# EAGLE design cc3100-breakout (EAGLE 6.5.0)
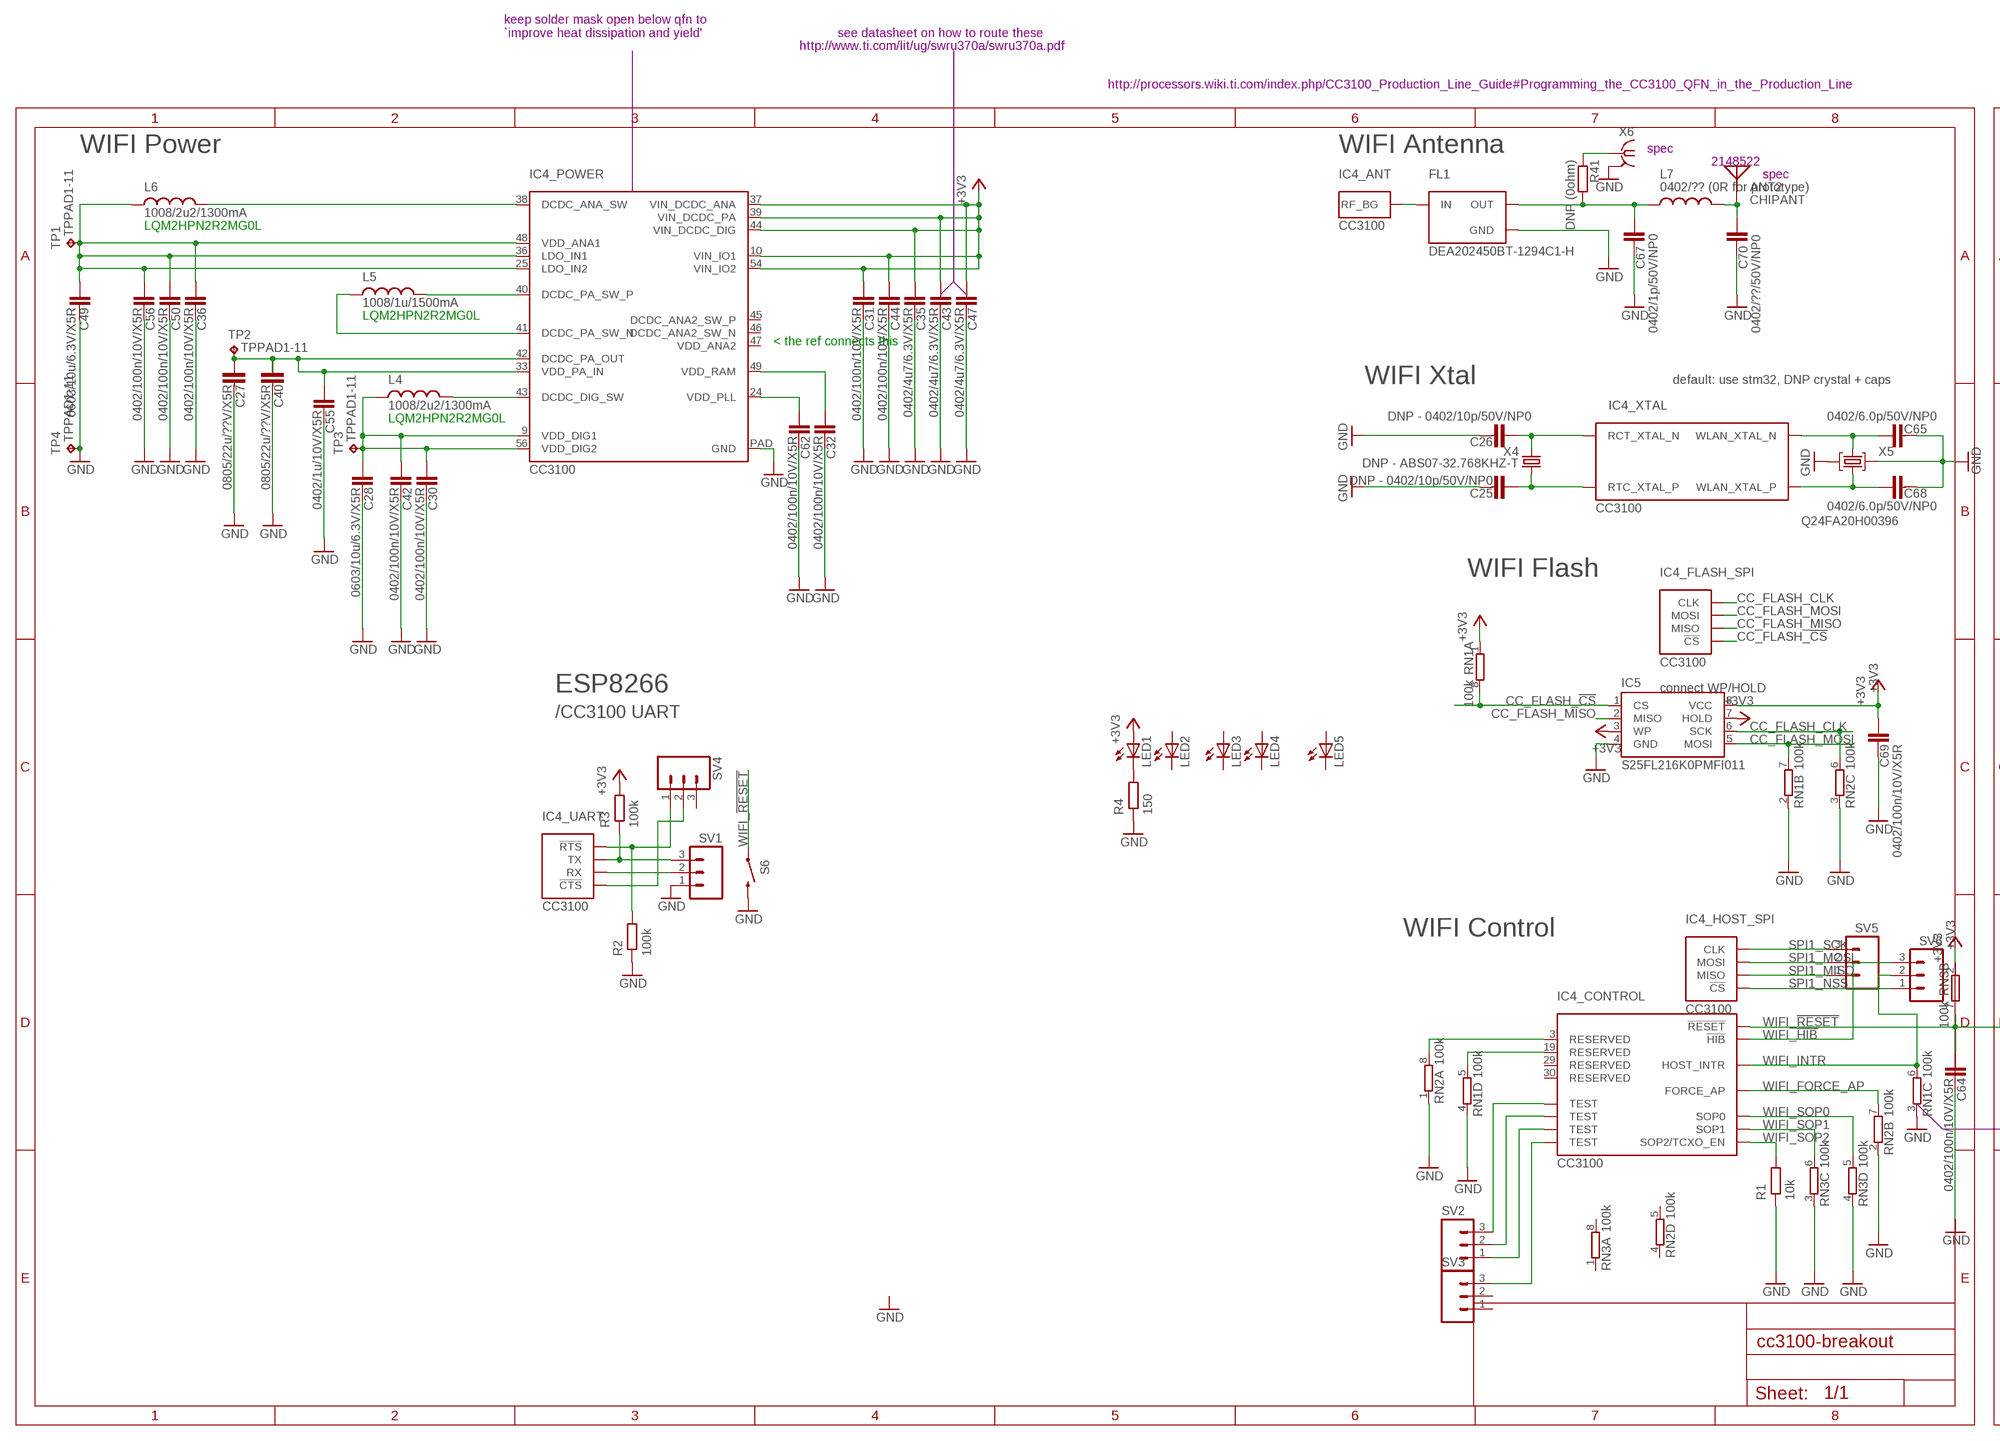
[diagram p0: schematic, sheet 1, part 1 of 2]
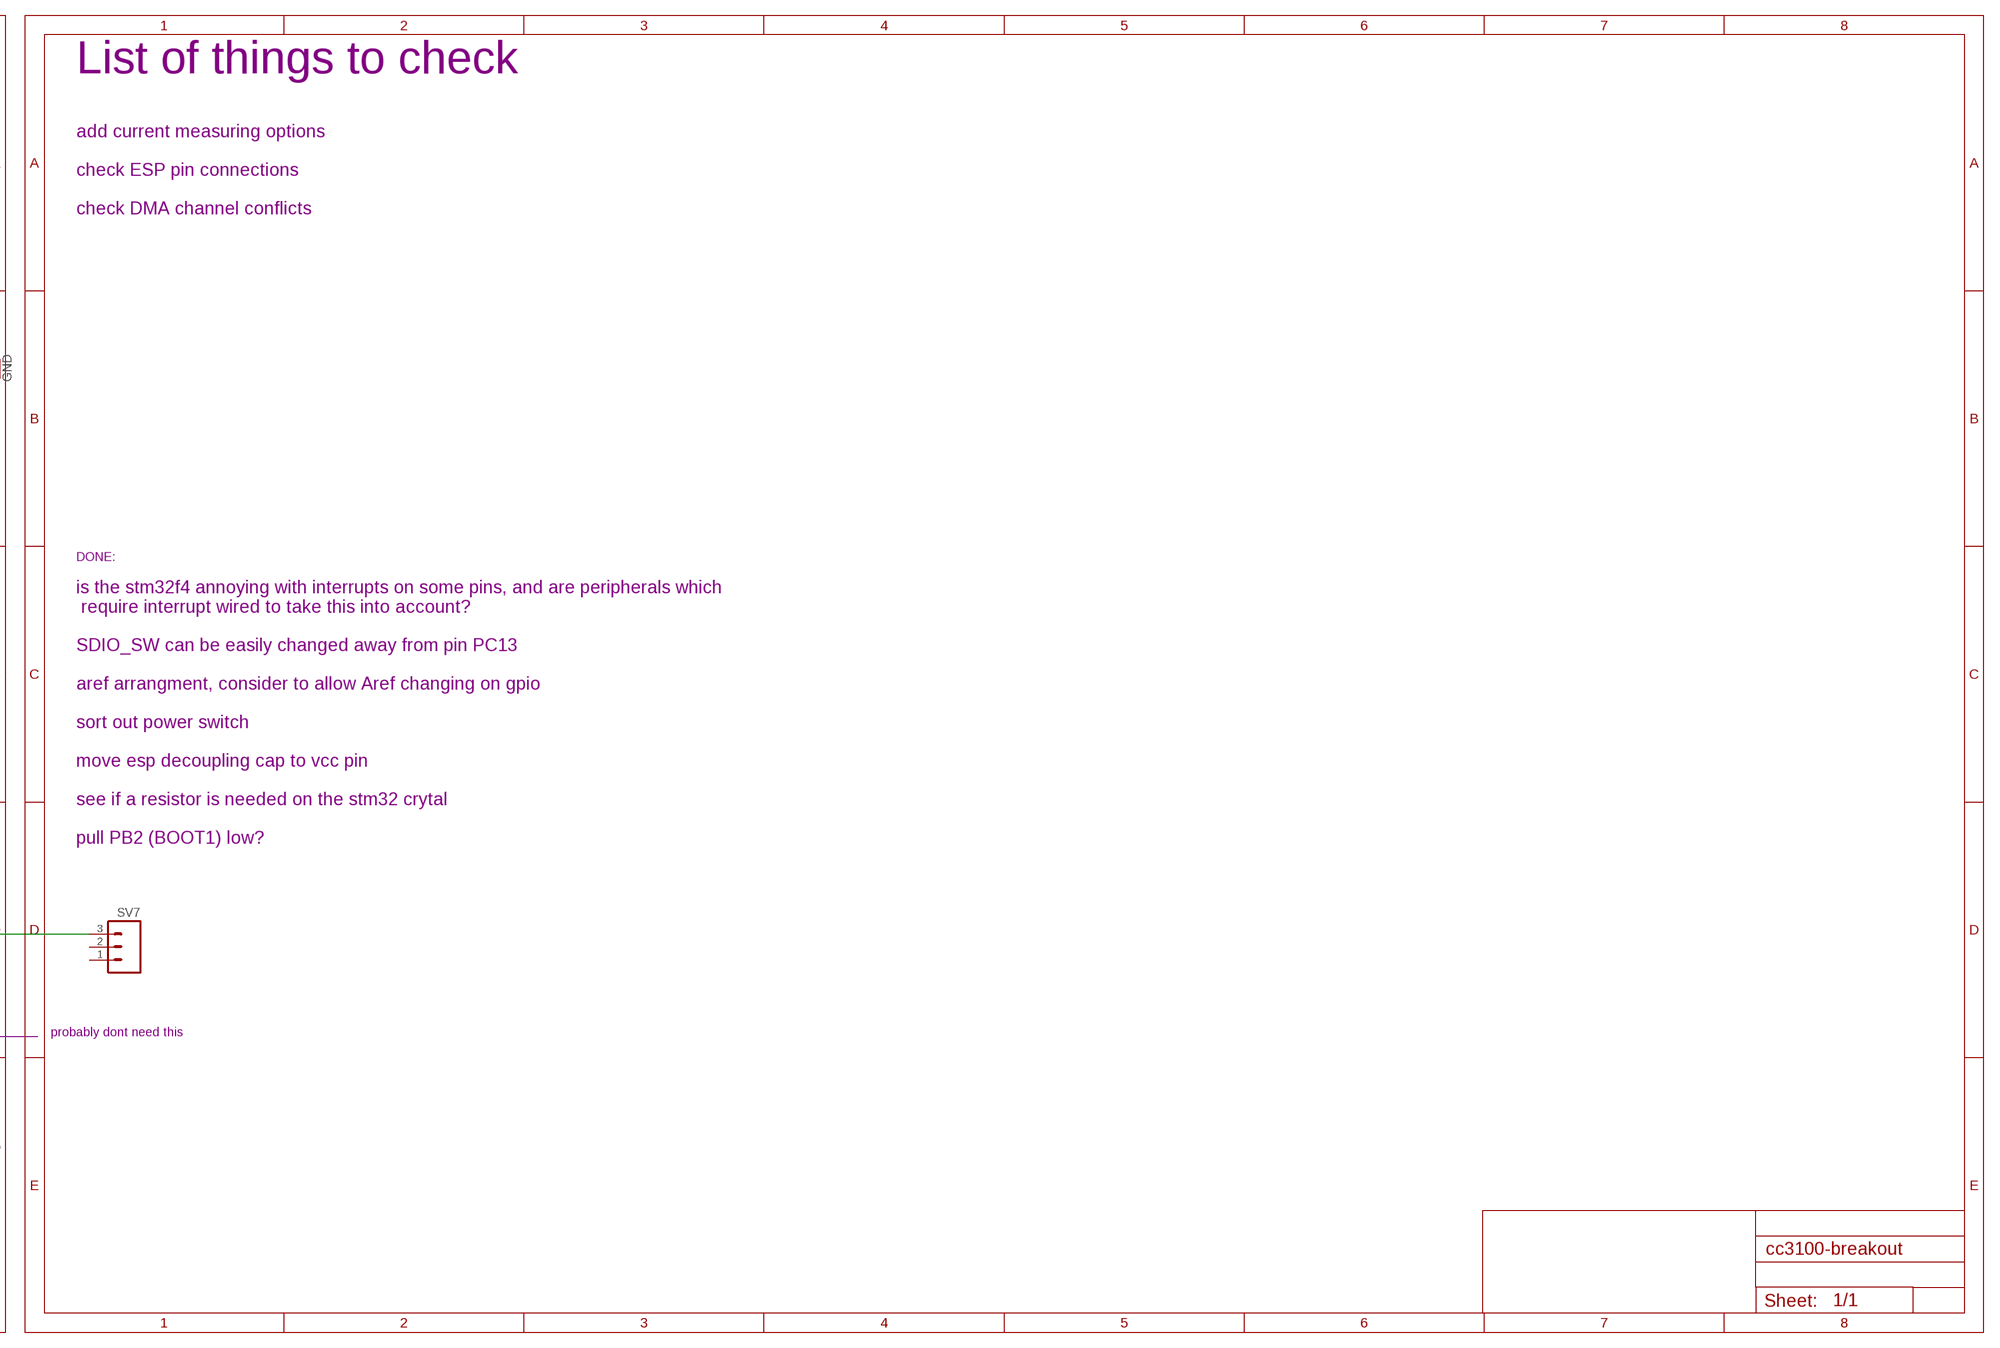
[diagram p1: schematic, sheet 1, part 2 of 2]

## Parts
ANT2  CHIPANT  [2450AT42A100]
C25  DNP - 0402/10p/50V/NP0  CAPACITOR0603-N  [C0603-N]
C26  DNP - 0402/10p/50V/NP0  CAPACITOR0603-N  [C0603-N]
C27  0805/22u/??V/X5R  CAPACITOR0805-N  [C0805-N]
C28  0603/10u/6.3V/X5R  C-EUC0603K-SMALL  [C0603K-SMALL]
C30  0402/100n/10V/X5R  C-EUC0402-SMALLER  [C0402-SMALLER]
C31  0402/100n/10V/X5R  C-EUC0402-SMALLER  [C0402-SMALLER]
C32  0402/100n/10V/X5R  C-EUC0402-SMALLER  [C0402-SMALLER]
C35  0402/4u7/6.3V/X5R  C-EUC0402-SMALLER  [C0402-SMALLER]
C36  0402/100n/10V/X5R  C-EUC0402-SMALLER  [C0402-SMALLER]
C40  0805/22u/??V/X5R  CAPACITOR0805-N  [C0805-N]
C42  0402/100n/10V/X5R  C-EUC0402-SMALLER  [C0402-SMALLER]
C43  0402/4u7/6.3V/X5R  C-EUC0402-SMALLER  [C0402-SMALLER]
C44  0402/100n/10V/X5R  C-EUC0402-SMALLER  [C0402-SMALLER]
C47  0402/4u7/6.3V/X5R  C-EUC0402-SMALLER  [C0402-SMALLER]
C49  0603/10u/6.3V/X5R  C-EUC0603K-SMALL  [C0603K-SMALL]
C50  0402/100n/10V/X5R  C-EUC0402-SMALLER  [C0402-SMALLER]
C55  0402/1u/10V/X5R  C-EUC0402-SMALLER  [C0402-SMALLER]
C56  0402/100n/10V/X5R  C-EUC0402-SMALLER  [C0402-SMALLER]
C62  0402/100n/10V/X5R  C-EUC0402-SMALLER  [C0402-SMALLER]
C64  0402/100n/10V/X5R  C-EUC0402-SMALLER  [C0402-SMALLER]
C65  0402/6.0p/50V/NP0  CAPACITOR0603-N  [C0603-N]
C67  0402/1p/50V/NP0  C-EUC0402-SMALLER  [C0402-SMALLER]
C68  0402/6.0p/50V/NP0  CAPACITOR0603-N  [C0603-N]
C69  0402/100n/10V/X5R  C-EUC0402-SMALLER  [C0402-SMALLER]
C70  0402/??/50V/NP0  C-EUC0402-SMALLER  [C0402-SMALLER]
FL1  DEA202450BT-1294C1-H  [DEA202450BT]
IC4  CC3100  [VQFN-64]
IC5  S25FL216K0PMFI011  SPI_FLASH-X25XXSMD1  [SO08-EIAJ]
L4  1008/2u2/1300mA  INDUCTOR1008  [1008]
L5  1008/1u/1500mA  INDUCTOR1008  [1008]
L6  1008/2u2/1300mA  INDUCTOR1008  [1008]
L7  0402/?? (0R for prototype)  INDUCTOR-0402-NARROW  [L0402]
LED1  LEDCHIPLED_0603  [CHIPLED_0603]
LED2  LEDCHIPLED_0603  [CHIPLED_0603]
LED3  LEDCHIPLED_0603  [CHIPLED_0603]
LED4  LEDCHIPLED_0603  [CHIPLED_0603]
LED5  LEDCHIPLED_0603  [CHIPLED_0603]
R1  10k  RESISTOR0603-N  [R0603-N]
R2  100k  RESISTOR0603-N  [R0603-N]
R3  100k  RESISTOR0603-N  [R0603-N]
R4  150  RESISTOR0603-N  [R0603-N]
R41  DNP (0ohm)  R-EU_R0402-SMALLER  [R0402-SMALLER]
RN1  100k  4R-NEXB38V  [EXB38V]
RN2  100k  4R-NEXB38V  [EXB38V]
RN3  100k  4R-NEXB38V  [EXB38V]
S6  SWITCH-MOMENTARY-2SMD-1101NE  [TACTILE-SWITCH-1101NE]
SV1  M03PTH  [1X03]
SV2  M03PTH  [1X03]
SV3  M03PTH  [1X03]
SV4  M03PTH  [1X03]
SV5  M03PTH  [1X03]
SV6  M03PTH  [1X03]
SV7  M03PTH  [1X03]
TP1  TPPAD1-11  [P1-11]
TP2  TPPAD1-11  [P1-11]
TP3  TPPAD1-11  [P1-11]
TP4  TPPAD1-11  [P1-11]
X4  DNP - ABS07-32.768KHZ-T  RESONATOR_EPSON_FC_145  [RESONATOR_EPSON_FC_145]
X5  Q24FA20H00396  CRYSTAL-2.5X2.0  [CRYSTAL-2.5X2.0]
X6  MC-921  [MC-921]

## Nets
+3V3: C31.2 C35.2 C43.2 C44.2 C47.2 C69.2 IC4.10(_POWER:VIN_IO1) IC4.37(_POWER:VIN_DCDC_ANA) IC4.39(_POWER:VIN_DCDC_PA) IC4.44(_POWER:VIN_DCDC_DIG) IC4.54(_POWER:VIN_IO2) IC5.3(WP) IC5.7(HOLD) IC5.8(VCC) LED1.A R3.2 RN1.1 RN3.2
ANT [ANT]: ANT2.P$1 C70.1 L7.2
CC_FLASH_!CS: IC4.14(_FLASH_SPI:!CS) IC5.1(CS) RN1.8
CC_FLASH_CLK: IC4.11(_FLASH_SPI:CLK) IC5.6(SCK) RN2.6
CC_FLASH_MISO: IC4.13(_FLASH_SPI:MISO) IC5.2(MISO)
CC_FLASH_MOSI: IC4.12(_FLASH_SPI:MOSI) IC5.5(MOSI) RN1.7
GND: C25.1 C26.1 C27.1 C28.1 C30.1 C31.1 C32.1 C35.1 C36.1 C40.1 C42.1 C43.1 C44.1 C47.1 C49.1 C50.1 C55.1 C56.1 C62.1 C64.1 C65.1 C67.2 C68.1 C69.1 C70.2 FL1.GND@2(GND) FL1.GND@4(GND) IC4.PAD(_POWER:GND) IC5.4(GND) R1.1 R2.1 R4.1 RN1.2 RN1.3 RN1.4 RN2.1 RN2.2 RN2.3 RN3.3 RN3.4 S6.2 SV1.1 TP4.TP X5.2(GND) X5.4(GND) X6.2@1(GND) X6.2@2(GND)
N$1: IC4.50(_UART:!RTS) R2.2 SV4.1
N$2 [ANT]: C67.1 FL1.OUT L7.1 R41.2
N$3: FL1.IN IC4.31(_ANT:RF_BG)
N$4: IC4.58(_CONTROL:TEST) SV2.3
N$5: C26.2 IC4.52(_XTAL:RCT_XTAL_N) X4.P$1
N$6: IC4.59(_CONTROL:TEST) SV2.2
N$7: IC4.60(_CONTROL:TEST) SV2.1
N$8: C65.2 IC4.22(_XTAL:WLAN_XTAL_N) X5.3(C2)
N$9: C68.2 IC4.23(_XTAL:WLAN_XTAL_P) X5.1(C1)
N$10: IC4.3(_CONTROL:RESERVED) RN2.8
N$11: IC4.19(_CONTROL:RESERVED) RN1.5
N$12: IC4.62(_CONTROL:TEST) SV3.3
N$13: IC4.61(_UART:!CTS) SV4.2
N$14: LED1.C R4.2
N$16: IC4.38(_POWER:DCDC_ANA_SW) L6.2
N$17: C27.2 C40.2 C55.2 IC4.33(_POWER:VDD_PA_IN) IC4.42(_POWER:DCDC_PA_OUT) TP2.TP
N$18: C36.2 C49.2 C50.2 C56.2 IC4.25(_POWER:LDO_IN2) IC4.36(_POWER:LDO_IN1) IC4.48(_POWER:VDD_ANA1) L6.1 TP1.TP
N$19: IC4.43(_POWER:DCDC_DIG_SW) L4.2
N$20: C62.2 IC4.24(_POWER:VDD_PLL)
N$22: C28.2 C30.2 C42.2 IC4.9(_POWER:VDD_DIG1) IC4.56(_POWER:VDD_DIG2) L4.1 TP3.TP
N$23: IC4.40(_POWER:DCDC_PA_SW_P) L5.2
N$24: IC4.41(_POWER:DCDC_PA_SW_N) L5.1
N$25: C32.2 IC4.49(_POWER:VDD_RAM)
N$32: C25.2 IC4.51(_XTAL:RTC_XTAL_P) X4.P$2
N$40: IC4.55(_UART:TX) R3.1 SV1.3
N$48 [ANT]: R41.1 X6.1
SPI1_MISO: IC4.7(_HOST_SPI:MISO) SV5.1
SPI1_MOSI: IC4.6(_HOST_SPI:MOSI) SV5.2
SPI1_NSS: IC4.8(_HOST_SPI:!CS) SV6.1
SPI1_SCK: IC4.5(_HOST_SPI:CLK) SV5.3
USART6_TX: IC4.57(_UART:RX) SV1.2
WIFI_!HIB: IC4.2(_CONTROL:!HIB) SV6.3
WIFI_!RESET: C64.2 IC4.32(_CONTROL:!RESET) RN3.7 S6.1 SV7.3
WIFI_FORCE_AP: IC4.4(_CONTROL:FORCE_AP) RN2.7
WIFI_INTR: IC4.15(_CONTROL:HOST_INTR) RN1.6 SV6.2
WIFI_SOP0: IC4.35(_CONTROL:SOP0) RN3.5
WIFI_SOP1: IC4.34(_CONTROL:SOP1) RN3.6
WIFI_SOP2: IC4.21(_CONTROL:SOP2/TCXO_EN) R1.2
Unconnected: IC4.29(_CONTROL:RESERVED) IC4.30(_CONTROL:RESERVED) IC4.45(_POWER:DCDC_ANA2_SW_P) IC4.46(_POWER:DCDC_ANA2_SW_N) IC4.47(_POWER:VDD_ANA2) LED2.A LED2.C LED3.A LED3.C LED4.A LED4.C LED5.A LED5.C RN2.4 RN2.5 RN3.1 RN3.8 SV3.1 SV3.2 SV4.3 SV7.1 SV7.2

## Notes on the sheet
- keep solder mask open below qfn to 
  `improve heat dissipation and yield'
- see datasheet on how to route these
- http://www.ti.com/lit/ug/swru370a/swru370a.pdf
- http://processors.wiki.ti.com/index.php/CC3100_Production_Line_Guide#Programming_the_CC3100_QFN_in_the_Production_Line
- WIFI Power | WIFI Antenna | spec
- 2148522 | List of things to check
- spec
- LQM2HPN2R2MG0L | add current measuring options
- check ESP pin connections
- check DMA channel conflicts
- LQM2HPN2R2MG0L
- < the ref connects this
- WIFI Xtal | default: use stm32, DNP crystal + caps
- LQM2HPN2R2MG0L
- WIFI Flash
- DONE:
- ESP8266 | connect WP/HOLD
- is the stm32f4 annoying with interrupts on some pins, and are peripherals which
   require interrupt wired to take this into account?
- /CC3100 UART
- SDIO_SW can be easily changed away from pin PC13
- aref arrangment, consider to allow Aref changing on gpio
- sort out power switch
- move esp decoupling cap to vcc pin
- see if a resistor is needed on the stm32 crytal
- WIFI Control | pull PB2 (BOOT1) low?
- probably dont need this

## Library data of the parts
ANT2 = TiLDA Mk3 Parts:CHIPANT
C25-C27 C40 C65 C68 = passives-7351:CAPACITOR
C28 C30-C32 C35 C36 C42-C44 C47 C49 C50 C55 C56 C62 C64 C67 C69 C70 = TiLDA Mk3 Parts:C-EU: CAPACITOR, European symbol
FL1 = TiLDA Mk3 Parts:DEA202450BT-1294C1-H
IC4 = TiLDA Mk3 Parts:CC3100
IC5 = TiLDA Mk3 Parts:SPI_FLASH-X25XX: 8pin SPI Flash series x25xx. Works with devices like W25X32 and BR25L32
L4-L7 = TiLDA Mk3 Parts:INDUCTOR: Inductors Basic Inductor/Choke - 0603 and 1206. Footprints are not proven and vary greatly between part numbers.
LED1-LED5 = led:LED: LED OSRAM: - CHIPLED LG R971, LG N971, LY N971, LG Q971, LY Q971, LO R971, LY R971 LH N974, LH R974 LS Q976, LO Q976, LY Q976 LO Q996 - Hyper CHIPLED LW Q18S LB Q993, LB Q99A, LB R99A - SideLED LS A670, LO A670, LY A670, LG A670, LP A670 LB A673, LV A673, LT A673, LW A673 LH A674 LY A675 LS A676, LA A676, LO A676, LY A676, LW A676 LS A679, LY A679, LG A679 - Hyper Micro SIDELED® LS Y876, LA Y876, LO Y876, LY Y876 LT Y87S - SmartLED LW L88C, LW L88S LB L89C, LB L89S, LG L890 LS L89K, LO L89K, LY L89K LS L896, LA L896, LO L896, LY L896 - TOPLED LS T670, LO T670, LY T670, LG T670, LP T670 LSG T670, LSP T670, LSY T670, LOP T670, LYG T670 LG T671, LOG T671, LSG T671 LB T673, LV T673, LT T673, LW T673 LH T674 LS T676, LA T676, LO T676, LY T676, LB T676, LH T676, LSB T676, LW T676 LB T67C, LV T67C, LT T67C, LS T67K, LO T67K, LY T67K, LW E67C LS E67B, LA E67B, LO E67B, LY E67B, LB E67C, LV E67C, LT E67C LW T67C LS T679, LY T679, LG T679 LS T770, LO T770, LY T770, LG T770, LP T770 LB T773, LV T773, LT T773, LW T773 LH T774 LS E675, LA E675, LY E675, LS T675 LS T776, LA T776, LO T776, LY T776, LB T776 LHGB T686 LT T68C, LB T68C - Hyper Mini TOPLED® LB M676 - Mini TOPLED Santana® LG M470 LS M47K, LO M47K, LY M47K Source: http://www.osram.convergy.de LUXEON: - LUMILED® LXK2-PW12-R00, LXK2-PW12-S00, LXK2-PW14-U00, LXK2-PW14-V00 LXK2-PM12-R00, LXK2-PM12-S00, LXK2-PM14-U00 LXK2-PE12-Q00, LXK2-PE12-R00, LXK2-PE12-S00, LXK2-PE14-T00, LXK2-PE14-U00 LXK2-PB12-K00, LXK2-PB12-L00, LXK2-PB12-M00, LXK2-PB14-N00, LXK2-PB14-P00, LXK2-PB14-Q00 LXK2-PR12-L00, LXK2-PR12-M00, LXK2-PR14-Q00, LXK2-PR14-R00 LXK2-PD12-Q00, LXK2-PD12-R00, LXK2-PD12-S00 LXK2-PH12-R00, LXK2-PH12-S00 LXK2-PL12-P00, LXK2-PL12-Q00, LXK2-PL12-R00 Source: www.luxeon.com KINGBRIGHT: KA-3528ASYC Source: www.kingbright.com
R1-R4 = passives-7351:RESISTOR
R41 = TiLDA Mk3 Parts:R-EU_: RESISTOR, European symbol
RN1-RN3 = resistor-dil:4R-N: Array Chip Resistor Source: RS Component / Phycomp; OC_FARNELL: unknown; OC_NEWARK: unknown
S6 = SparkFun-Electromechanical:SWITCH-MOMENTARY-2: Various NO switches- pushbuttons, reed, etc; PROD_ID: SWCH-00815
SV1-SV7 = TiLDA Mk3 Parts:M03: Header 3 Standard 3-pin 0.1" header. Use with straight break away headers (SKU : PRT-00116), right angle break away headers (PRT-00553), swiss pins (PRT-00743), machine pins (PRT-00117), and female headers (PRT-00115). Molex polarized connector foot print use with SKU : PRT-08232 with associated crimp pins and housings.
TP1-TP4 = TiLDA Mk3 Parts:TP: Test pad
X4 = TiLDA Mk3 Parts:RESONATOR_EPSON_FC_145
X5 = TiLDA Mk3 Parts:CRYSTAL
X6 = con-coax:MC-921: COAX. MICROWAVE CONNECTOR O/D diam 2.1 Source: www.tycoelectronics.com .. Electronics .. ENG_CD_1775146_A2.pdf; OC_FARNELL: unknown; OC_NEWARK: unknown

## Net classes
0 default: width 0.15 mm, drill 0.3 mm
1 ANT: width 1.27 mm, drill 0.4 mm, clearance 0.4 mm
2 90R: width 0.5 mm, drill 0.3 mm, clearance 0.7 mm to class 0, clearance 0.1 mm

## Board
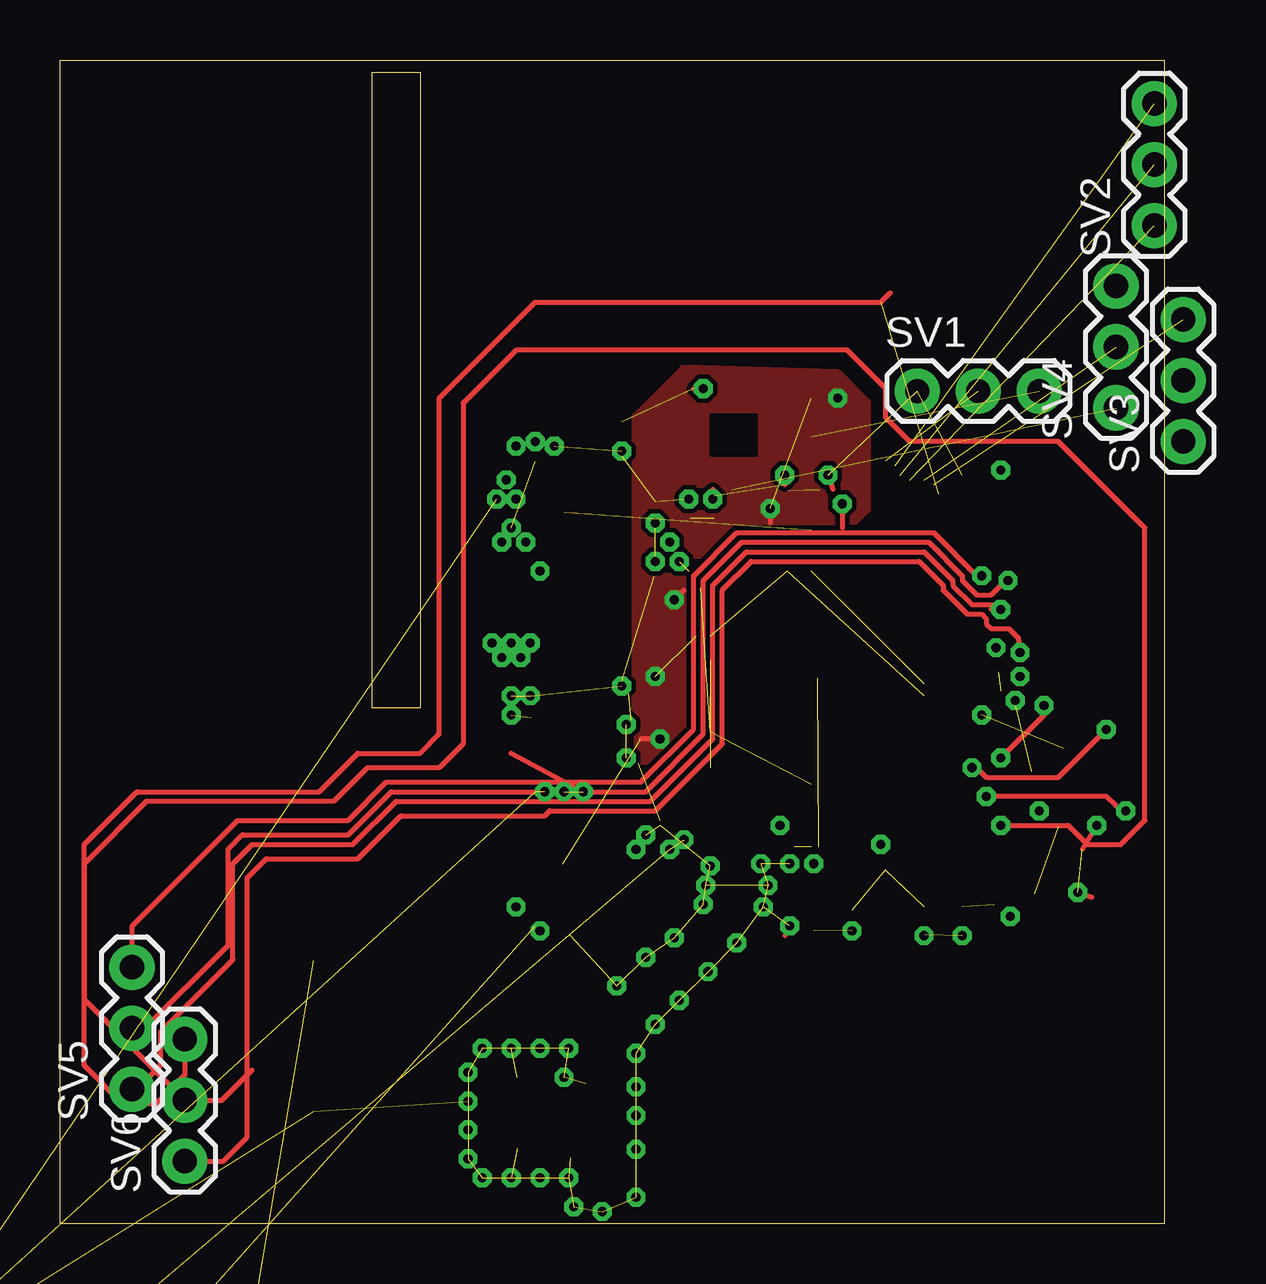
[diagram p2: board, top side]
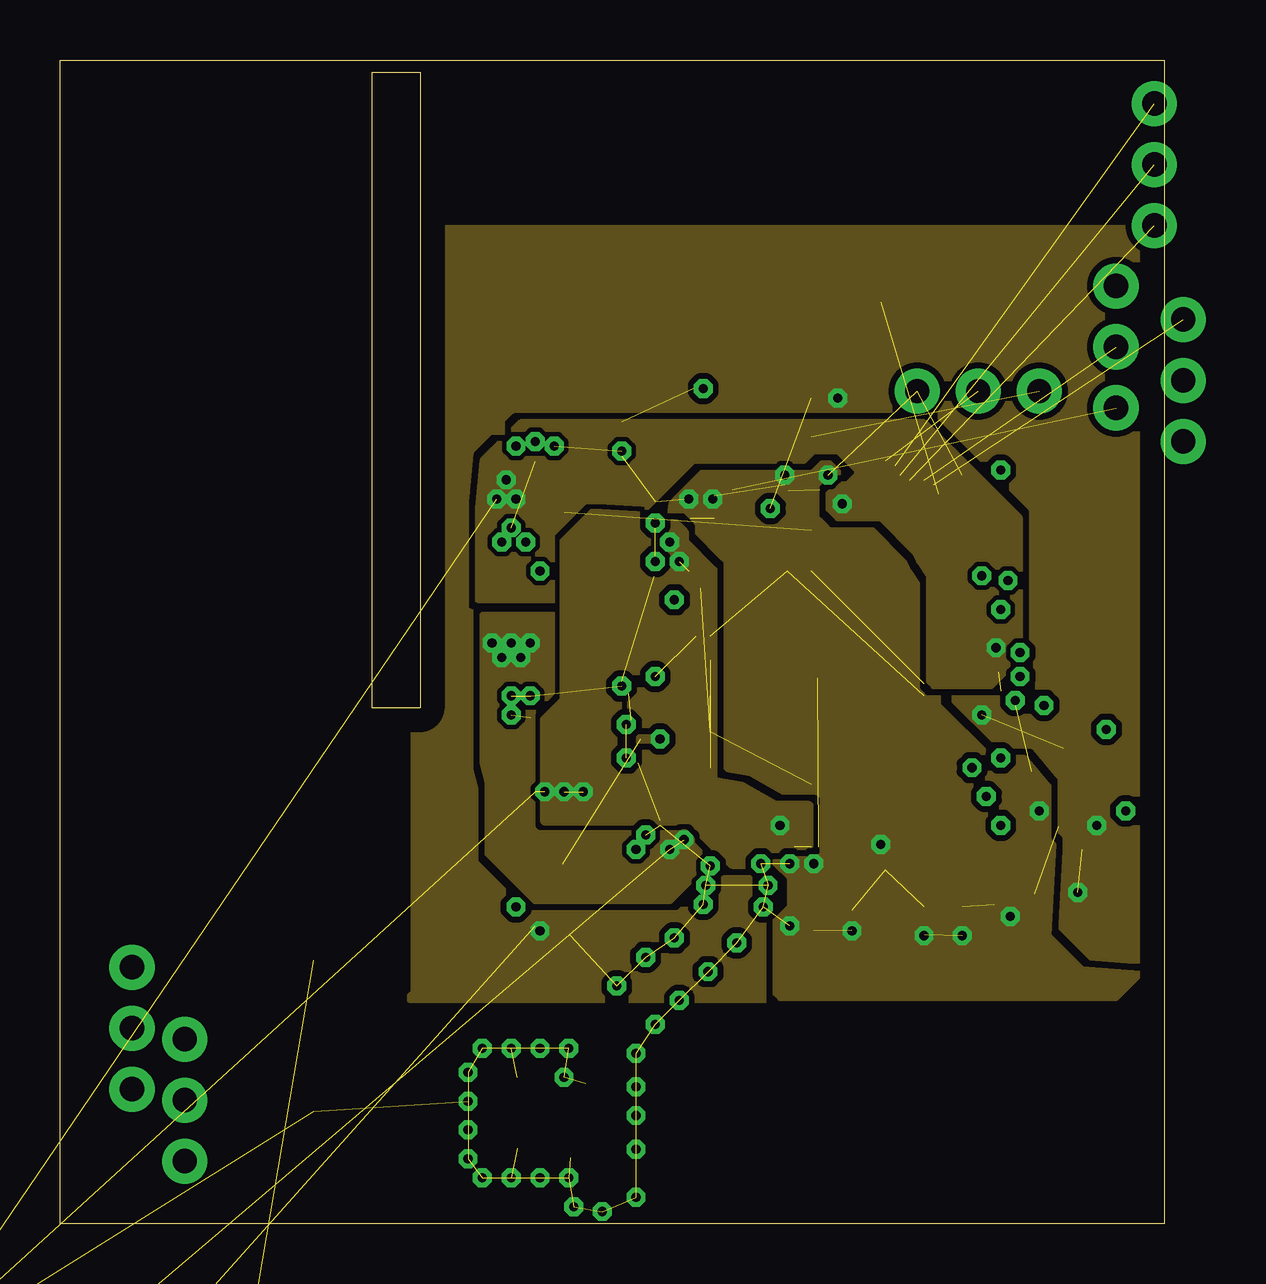
[diagram p3: board, inner layer Route2]
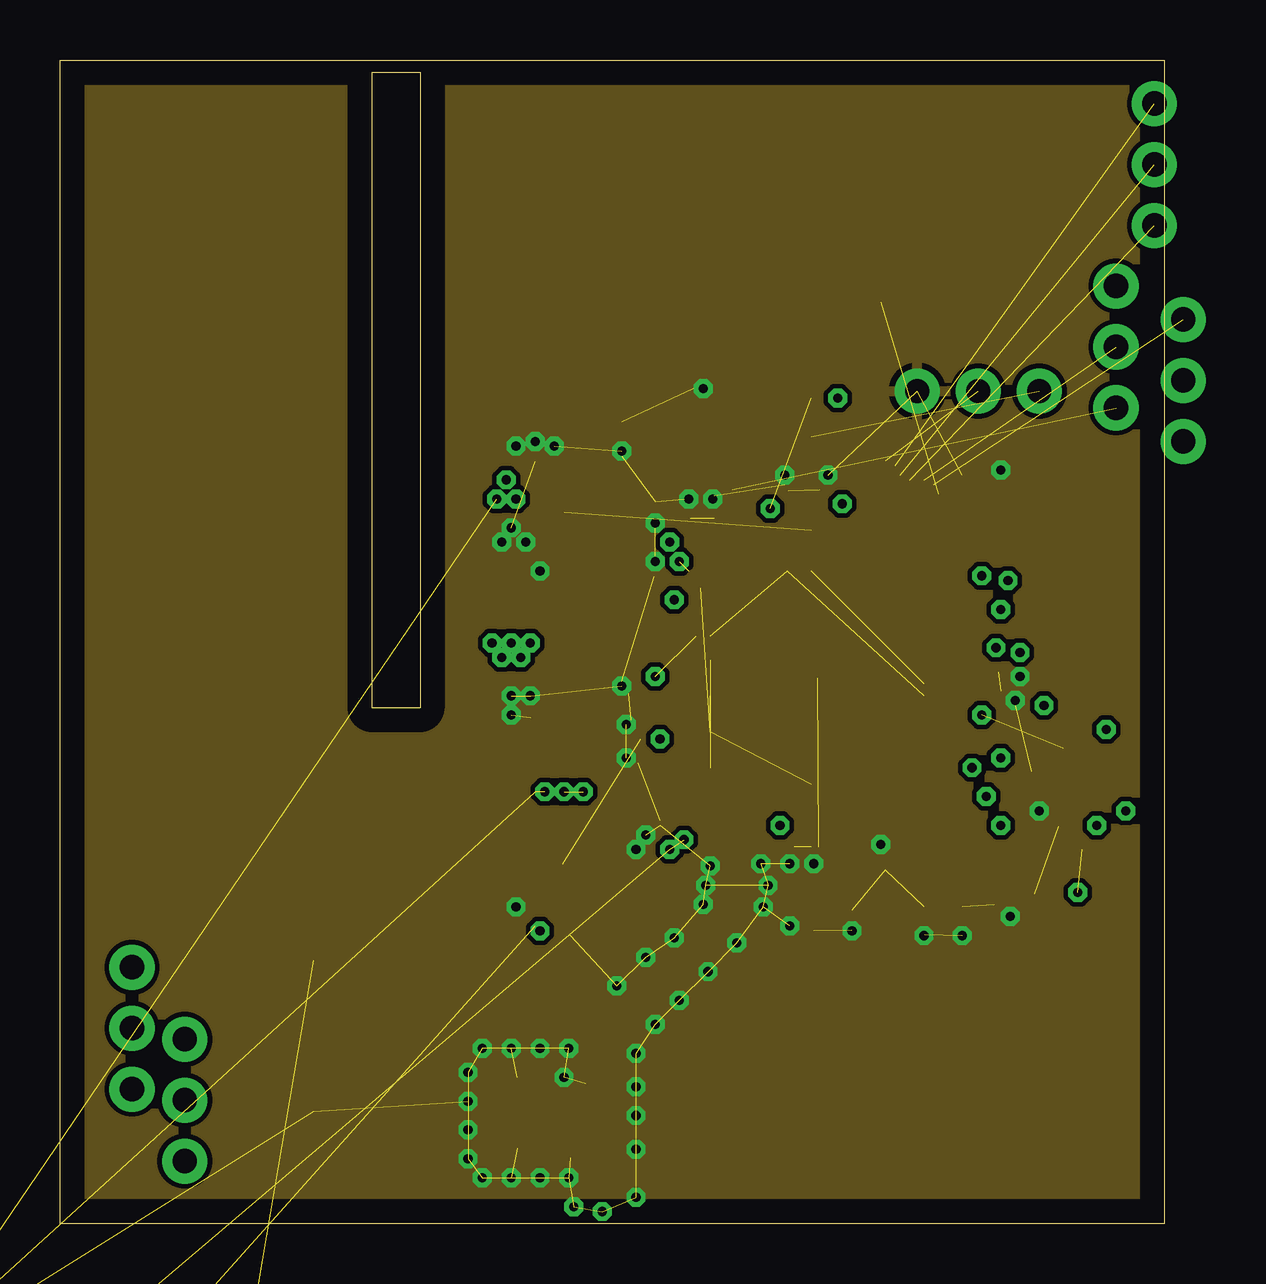
[diagram p4: board, inner layer Route15]
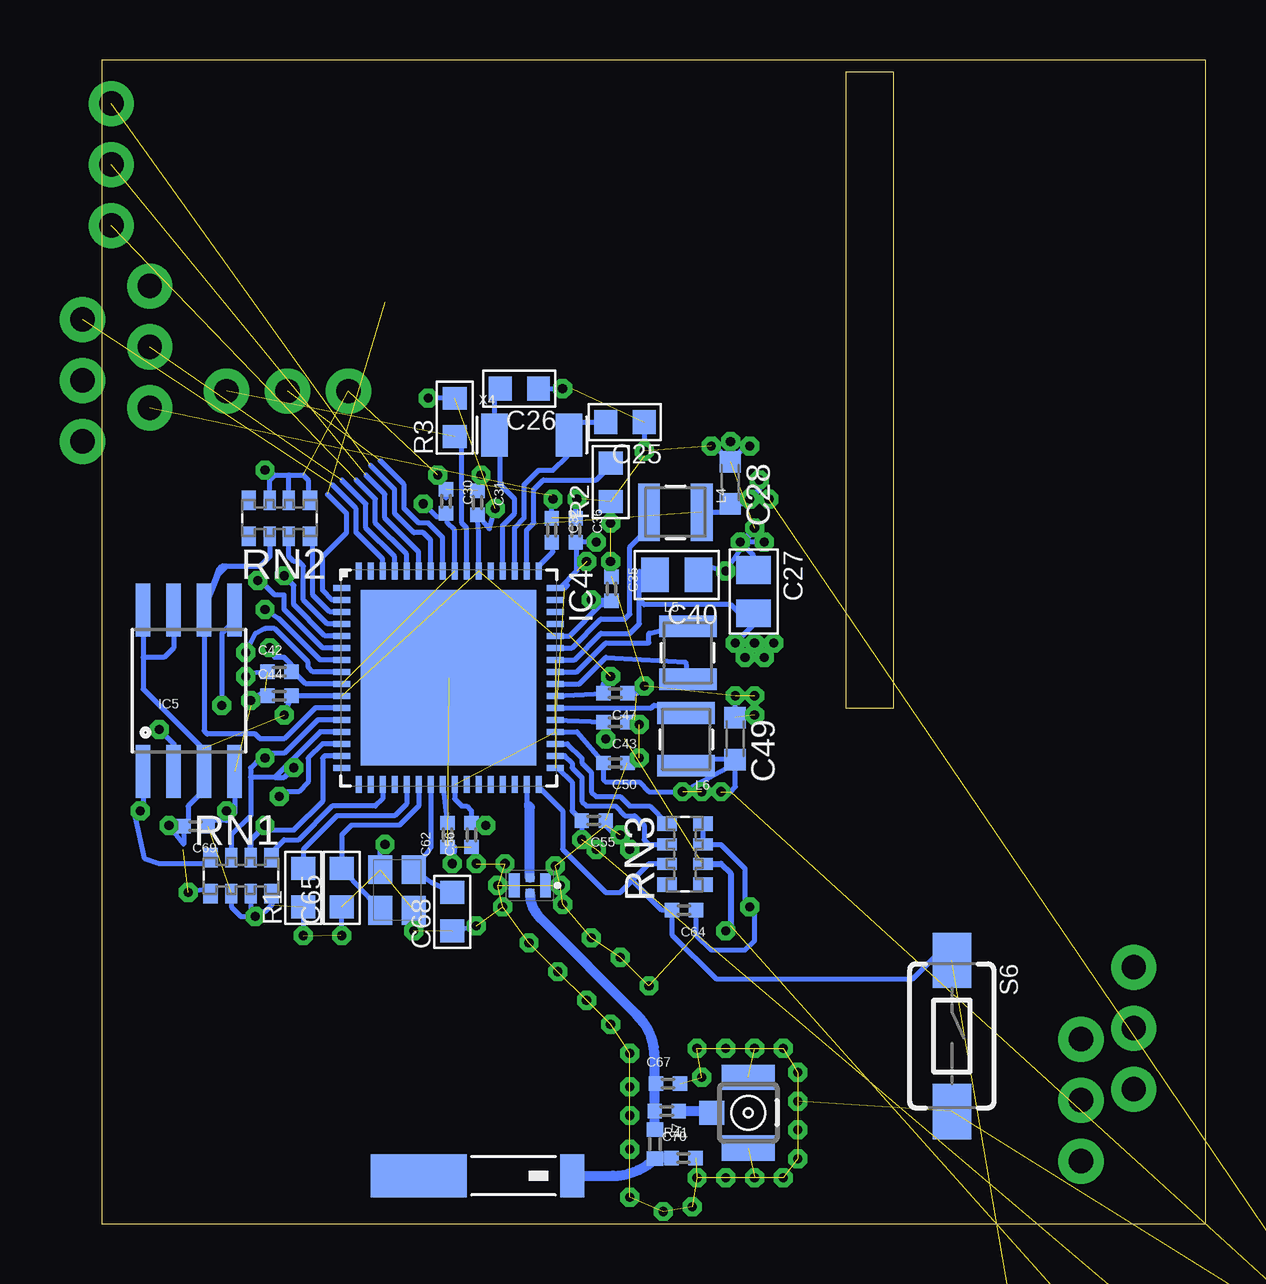
[diagram p5: board, bottom side, seen from below]

Size 46 x 48.5 mm. Coordinates in mm from the lower left corner, seen from the top.
Outline: 46,48.5 46,0 0,0 0,48.5 46,48.5
Outline: 15,48 15,21.5 13,21.5 13,48 15,48
Copper layers (1*2*15*16): Top 0.035mm / dielectric 0.15mm / Route2 0.035mm / dielectric 1.5mm / Route15 0.035mm / dielectric 0.2mm / Bottom 0.035mm
Design rules "default *": minimum track width 0.2mm, minimum drill 15mil, track to track 0.2mm, track to pad 0.2mm, pad to pad 0.2mm, via to via 0.2mm, smd to smd 0.2mm, copper to edge 40mil, drill to drill 8mil, minimum pad ring 10mil, minimum via ring 8mil, stop-mask expansion 4mil, vias tented up to drill 0mil, thermal gap 10mil

### Footprints (pad centres in the part's own frame; a part is rotated, then mirrored left to right if it is on the bottom)
2450AT42A100 = smd 1 x 1.8: P$1 -0.5,0 | smd 4 x 1.8: P$2 5.9,0
C0603-N = smd 0.95 x 1: 1 -0.8,0; 2 0.8,0
C0805-N = smd 1.15 x 1.45: 1 -0.9,0; 2 0.9,0
C0603K-SMALL = smd 0.889 x 0.889: 1 -0.875,0; 2 0.875,0
C0402-SMALLER = smd 0.6 x 0.6: 1 -0.5,0; 2 0.5,0
DEA202450BT = smd 0.45 x 1: GND@2 0.65,0; GND@4 -0.65,0 | smd 0.35 x 0.35: IN 0,-0.325; OUT 0,0.325
VQFN-64 = smd 0.25 x 0.7: 1 -3.75,-4.45; 2 -3.25,-4.45; 3 -2.75,-4.45; 4 -2.25,-4.45; 5 -1.75,-4.45; 6 -1.25,-4.45; 7 -0.75,-4.45; 8 -0.25,-4.45; 9 0.25,-4.45; 10 0.75,-4.45; 11 1.25,-4.45; 12 1.75,-4.45; 13 2.25,-4.45; 14 2.75,-4.45; 15 3.25,-4.45; 16 3.75,-4.45; 33 3.75,4.45; 34 3.25,4.45; 35 2.75,4.45; 36 2.25,4.45; 37 1.75,4.45; 38 1.25,4.45; 39 0.75,4.45; 40 0.25,4.45; 41 -0.25,4.45; 42 -0.75,4.45; 43 -1.25,4.45; 44 -1.75,4.45; 45 -2.25,4.45; 46 -2.75,4.45; 47 -3.25,4.45; 48 -3.75,4.45 | smd 0.7 x 0.25: 17 4.45,-3.75; 18 4.45,-3.25; 19 4.45,-2.75; 20 4.45,-2.25; 21 4.45,-1.75; 22 4.45,-1.25; 23 4.45,-0.75; 24 4.45,-0.25; 25 4.45,0.25; 26 4.45,0.75; 27 4.45,1.25; 28 4.45,1.75; 29 4.45,2.25; 30 4.45,2.75; 31 4.45,3.25; 32 4.45,3.75; 49 -4.45,3.75; 50 -4.45,3.25; 51 -4.45,2.75; 52 -4.45,2.25; 53 -4.45,1.75; 54 -4.45,1.25; 55 -4.45,0.75; 56 -4.45,0.25; 57 -4.45,-0.25; 58 -4.45,-0.75; 59 -4.45,-1.25; 60 -4.45,-1.75; 61 -4.45,-2.25; 62 -4.45,-2.75; 63 -4.45,-3.25; 64 -4.45,-3.75 | smd 7.3 x 7.3: PAD 0,0
SO08-EIAJ = smd 0.61 x 2.21: 1 -1.905,-3.378; 2 -0.635,-3.378; 3 0.635,-3.378; 4 1.905,-3.378; 5 1.905,3.353; 6 0.635,3.353; 7 -0.635,3.353; 8 -1.905,3.353
1008 = smd 0.9 x 2.4: 1 -1.1,0; 2 1.1,0
L0402 = smd 0.6 x 0.7: 1 -0.6,0; 2 0.6,0
CHIPLED_0603 = smd 0.8 x 0.8: A 0,-0.75; C 0,0.75
R0603-N = smd 0.95 x 1: 1 -0.8,0; 2 0.8,0
R0402-SMALLER = smd 0.6 x 0.6: 1 -0.5,0; 2 0.5,0
EXB38V = smd 0.6 x 0.8: 1 -1.275,-0.75; 4 1.275,-0.75; 5 1.275,0.75; 8 -1.275,0.75 | smd 0.5 x 0.8: 2 -0.4,-0.75; 3 0.4,-0.75; 6 0.4,0.75; 7 -0.4,0.75
TACTILE-SWITCH-1101NE = smd 2.3 x 1.6: 1 -3.15,0; 2 3.15,0
1X03 = drill 1.016 pad 1.88: 1 0,0; 2 2.54,0; 3 5.08,0
P1-11 = drill 1.15 pad 1.676 octagon: TP 0,0
RESONATOR_EPSON_FC_145 = smd 1.1 x 1.8: P$1 -1.55,0; P$2 1.55,0
CRYSTAL-2.5X2.0 = smd 1.2 x 1: 1 -0.85,0.7; 2 0.85,0.7; 3 0.85,-0.7; 4 -0.85,-0.7
MC-921 = smd 1 x 1.05: 1 0,1.528 | smd 1.05 x 2.2: 2@1 -1.475,0; 2@2 1.475,0

### Placement (x,y rotation side)
ANT2  26.9,1.99 180 bottom
C25  24.2,33.4 180 bottom
C26  28.6,34.8 180 bottom
C27  18.84,26.34 270 bottom
C28  19.81,30.88 270 bottom
C30  31.65,30.1 270 bottom
C31  30.35,30.05 270 bottom
C32  27.25,28.9 270 bottom
C35  24.76,26.46 270 bottom
C36  26.25,28.9 270 bottom
C40  22.04,27.04 180 bottom
C42  38.6,23 0 bottom
C43  24.6,20.9 180 bottom
C44  38.6,22 0 bottom
C47  24.6,22.1 180 bottom
C49  19.61,20.21 270 bottom
C50  24.6,19.2 180 bottom
C55  25.5,16.8 180 bottom
C56  30.6,16.2 90 bottom
C62  31.6,16.2 90 bottom
C64  21.74,13.06 180 bottom
C65  36,14 90 bottom
C67  22.41,5.83 0 bottom
C68  31.4,13 90 bottom
C69  42.09,16.56 180 bottom
C70  21.76,2.73 0 bottom
FL1  28.16,14.09 180 bottom
IC4  31.55,22.75 270 bottom
IC5  42.37,22.22 0 bottom
L4  22.1,29.65 180 bottom
L5  21.58,23.79 270 bottom
L6  21.65,20.18 90 bottom
L7  22.95,3.31 270 bottom
LED1  -3,-12.4 0 top  (outside the outline)
LED2  -7.8,-12.4 0 top  (outside the outline)
LED3  -12.6,-12.4 0 top  (outside the outline)
LED4  -17.4,-12.4 0 top  (outside the outline)
LED5  -22.2,-12.4 0 top  (outside the outline)
R1  37.6,14 90 bottom
R2  24.8,30.9 90 bottom
R3  31.3,33.6 90 bottom
R4  -22.4,-16.4 0 top  (outside the outline)
R41  22.46,4.69 180 bottom
RN1  40.2,14.5 0 bottom
RN2  38.6,29.4 180 bottom
RN3  21.7,15.4 90 bottom
S6  10.58,7.82 270 bottom
SV1  35.72,34.7 0 top
SV2  45.6,41.6 90 top
SV3  46.8,32.6 90 top
SV4  44,34 90 top
SV5  3,5.6 90 top
SV6  5.2,2.6 90 top
SV7  1.4,-13 0 top  (outside the outline)
TP1  -22.6,-20.6 0 top  (outside the outline)
TP2  -22.6,-25.2 0 top  (outside the outline)
TP3  -22.6,-29.8 0 top  (outside the outline)
TP4  -22.6,-36 0 top  (outside the outline)
X4  28.08,32.86 0 bottom
X5  33.69,13.9 270 bottom
X6  19.06,4.62 90 bottom

### Tracks (layer width: path | path; a pad name or v marks a point on that pad's centre or on a via)
+3V3  (via drill 0.38)  (9 unrouted)
  Top 0.2: v25,20.2 24.2,20.2 | v24.8,22.8 24.6,23 | v29.6,29.8 29.6,29.2 | v38.4,21.2 38.2,21.2 | v43.2,16.6 42.6,15.6 | v42.4,13.8 43,13.6 | v25.6,26 26,26.4 | v32.4,34.4 32.4,34.2
  Bottom 0.2: IC4.37 C43.2 25.1,20.7 v25,20.2 | IC4.39 C47.2 25.1,22.5 v24.8,22.8 | IC4.10 C44.2 38.3,21.5 v38.4,21.2 | IC4.44 26.5,24.5 25.2,25.8 24.92,25.8 24.96,25.84 24.96,25.96 | IC4.54 30.3,28.8 C31.2 29.85,28.95 v29.6,29.8 | IC5.8 44.27,23.6 | 44.27,23.6 44.27,22.27 41.8,19.8 41.8,18.91 IC5.3 41.73,18.07 42.4,17.4 42.4,16.75 C69.2 42.59,15.81 v43.2,16.6 | IC5.7 43.01,24 43.4,23.6 44.27,23.6 | RN1.1 41.67,13.93 v42.4,13.8 | C35.2 24.96,25.96 | 24.96,25.96 v25.6,26 | R3.2 v32.4,34.4
  Bottom 0.254: RN3.2 20.2,15 19.8,14.6 19.8,12.4 v20,12.2
  pour Route2 (isolate 0.254, rank 5): 45.8,10.4 45.8,41 45.4,41.4 18.8,41.4 15.2,41.4 14.8,41 14.8,9.6 14.6,9.4 42.8,9.4 43.4,10
  pour Top (rank 2): 26.8,17.2 26.8,27 27.6,27.8 31.6,27.8 33.6,29.8 33.6,34.2 32.4,35.4 26,35.6 24,33.6 24,17 25.4,16.8 26.4,17
ANT
  Bottom 0.406: ANT2.P$1 24.69,1.99 arc-45 L7.2 arc45 22.9,2.73 C70.1
CC_FLASH_!CS  (via drill 0.38)
  Top 0.2: v44.4,17.2 44,17.4 43.6,17.8 v38.6,17.8
  Bottom 0.2: IC4.14 36.8,20 37.4,19.4 37.4,18.4 37.8,18 38.4,18 v38.6,17.8 | IC5.1 44.27,17.48 v44.4,17.2 44.6,17 44.2,15.2 43.6,15 41.6,15 41.55,15.25 RN1.8
CC_FLASH_CLK
  Bottom 0.2: RN2.6 39,27.8 39.4,27.4 40.8,27.4 | 40.8,27.4 41,27.4 41.13,27.27 IC5.6 | IC5.6 41.13,27.07 40.8,27.4 | IC4.11 37.1,21.5 38.4,20.2 39.4,20.2 39.6,20.4 41.6,20.4 41.73,20.54 IC5.6
CC_FLASH_MISO  (via drill 0.38)
  Top 0.2: v38,19 38.2,19 38.6,18.6 41.6,18.6 v43.6,20.6
  Bottom 0.2: IC4.13 36.9,20.5 38.8,18.6 | 38.8,18.6 39.8,18.6 | 38.8,18.6 38.4,18.6 v38,19 | v43.6,20.6 43,20 IC5.2
CC_FLASH_MOSI  (via drill 0.38)
  Top 0.2: v41,21.6 41,21.2 v39.2,19.4
  Bottom 0.2: IC4.12 37,21 38.4,19.6 39.2,19.6 39.4,19.4 | IC5.5 40.47,25.14 41,24.6 v41,21.6 | v39.2,19.4 39.4,19.4 | 39.4,19.4 39.8,19 39.8,17 40.6,16.2 RN1.7
GND  (via drill 0.38)  (74 unrouted)
  Top 0.2: v23.6,19.4 23.4,19.4 | v23.6,20.8 23.4,20.8 | v23.4,22.4 23.4,22.6 | v32,31.2 32.2,30.6 | v30.2,31.2 30.2,30.8 | v39.8,21.8 39.8,21.6 | v39.2,31.4 39.4,31.6 | v39.6,12.8 39.6,12.6 | v30.4,12.4 30.2,12 | v34.2,15.8 34,15.8 | v36,12 36,11.8 | v33,12.2 33,12 | v19.4,28.4 19.2,28.4 | v24.8,27.6 24.8,27.8 | v26.2,30.2 26,30.2 | v27.2,30.2 27.2,30.6 | v24.8,29.2 24.8,29 | v26.8,34.8 26.4,34.8 | v23.4,32.2 23.4,32 | v37.6,12 37.6,11.8
  Bottom 0.2: C50.1 23.8,19.2 v23.6,19.4 | C43.1 23.8,21 v23.6,20.8 | C47.1 23.7,22.1 v23.4,22.4 | C30.1 31.65,30.25 v32,31.2 | C31.1 30.35,30.45 v30.2,31.2 | C62.1 31.3,15.7 v31.4,15 | C56.1 30.5,15.7 v30.4,15 | C42.1 40.1,22.9 v40,22.8 | C44.1 38.9,22.1 39.2,22.2 v39.8,21.8 | IC5.4 40.47,17.14 40.8,16.8 41.35,16.8 C69.1 | RN2.3 39,31 38.8,31.2 | 38.8,31.2 38.2,31.2 | 38.2,31.2 37.6,31.2 37.4,31 37.4,30.23 RN2.1 | RN2.2 38.2,31.2 | 38.8,31.2 39,31.2 v39.2,31.4 | C68.1 v30.4,12.4 | X5.4 34.39,15.61 v34.2,15.8 | C65.1 36.04,12.04 v36,12 | X5.2 v32.99,12.21 v33,12.2 | RN1.4 38.92,13.28 39.2,13 39.4,13 v39.6,12.8 | RN1.3 39.8,13 v39.6,12.8 | RN1.2 40.6,13.2 40.2,12.8 v39.6,12.8 | C27.1 18.84,27.84 v19.4,28.4 | C40.1 20.54,27.34 v20,27.2 v18.8,29 v19.4,28.4 | v18.4,28.4 v19.4,28.4 | v19,32.4 19.16,32.4 C28.1 | v19.8,32.6 19.8,31.77 C28.1 | v20.6,32.4 20.45,32.4 C28.1 | C35.1 24.76,27.56 v24.8,27.6 | C36.1 26.25,29.75 v26.2,30.2 | C32.1 27.25,30.35 v27.2,30.2 | R2.1 v24.8,29.2 | C26.1 v26.8,34.8 | C25.1 v23.4,32.2 | R1.1 v37.6,12 | RN3.4 RN3.3 20.2,15.8 19.2,14.8 19.2,13.4 v19,13.2 18.8,13 18.8,11.8 19.2,11.4 20.6,11.4 21.24,12.04 C64.1 | C49.1 v19.61,21.99 v19.6,22 | C55.1 25,16.6 v24,15.6
  Bottom 0.254: 40.47,17.14 40.8,17.14 v40.8,17.2
  other vias: 18.8,22 18.8,21.2 29.2,15 29.5,14.1 29.3,13.2 26.9,14.1 27.1,14.9 26.8,13.3 21,6.1 21.2,1.9 20,1.9 18.8,1.9 17.6,1.9 17,2.7 17,3.9 17,5.1 17,6.3 17.6,7.3 18.8,7.3 20,7.3 21.2,7.3 23.2,9.9 24.4,11.1 25.6,11.9 28.2,11.7 27,10.5 25.8,9.3 24.8,8.3 24,7.1 24,5.7 24,4.5 24,3.1 24,1.1 22.6,0.5 21.4,0.7 24.4,16.2
  pour Route15: 46.4,49.4 -1.4,49.4 -1.4,-1.2 49.2,-1.2 49.2,47.8
  pour Route2 (isolate 0.254, rank 3): 32.2,32.6 27.4,32.6 25.6,30.8 25.4,29.6 27.6,27.4 27.6,19.2 29.2,17.4 31,17.4 31.2,16.6 30.4,15.8 30.2,15.8 29.8,15.4 29.8,15 30.4,14.4 30.4,13.2 29.8,12.6 29.8,9.6 30,9.4 44,9.4 45,10.4 42.6,10.6 41.2,12 41.4,15.8 41.2,16 41.2,18.2 40.2,19.4 38.8,19.4 36.6,21.6 36.6,28.2
N$1  (1 unrouted)
  Bottom 0.2: R2.2 24.6,31.9 24.8,31.6 25.4,31 27.6,31 28,30.6 28,29.2 28.3,28.9 IC4.50
N$2
  Bottom 0.406: R41.2 22.96,6.91 arc-45 23.7,8.7 27.73,12.73 arc45 FL1.OUT | L7.1 22.95,4.67 arc-45 R41.2 | R41.2 22.96,5.71 arc45 C67.1
N$3
  Bottom 0.2: IC4.31 28.3,17.5 28.2,17.4
  Bottom 0.406: FL1.IN 28.16,17.36 28.2,17.4
N$4  (1 unrouted)
  Bottom 0.2: IC4.58 32.3,28.5 32.6,28.8 33,28.8 33.8,29.6 33.8,30.6 34.8,31.6
N$5
  Bottom 0.2: IC4.52 29.3,29.1 28.8,29.6 28.8,30.2 29.4,30.8 29.4,32.63 X4.P$1 29.63,34.57 C26.2
N$6  (1 unrouted)
  Bottom 0.2: IC4.59 32.8,28 34.2,29.4 34.2,30.4 35,31.2
N$7  (1 unrouted)
  Bottom 0.2: IC4.60 33.3,27.9 34.6,29.2 34.6,30.2 35.4,31
N$8
  Bottom 0.2: IC4.22 32.8,17.4 33.6,16.6 35.6,16.6 36,16.2 C65.2 | 36,14.78 C65.2 | X5.3 34.39,13.09 C65.2
N$9
  Bottom 0.2: IC4.23 32.3,15.66 X5.1 32.24,14.2 C68.2
N$10
  Bottom 0.2: IC4.3 36.5,25.5 37.2,26.2 37.2,28.52 RN2.8
N$11
  Bottom 0.2: IC4.19 34.3,17.7 34.6,17.4 36.4,17.4 37.8,16 38.4,16 38.92,15.47 RN1.5
N$12  (1 unrouted)
  Bottom 0.2: IC4.62 34.3,27.7 35.4,28.8 35.4,29.8 36.4,30.8
N$13  (1 unrouted)
  Bottom 0.2: IC4.61 33.8,27.8 35,29 35,30 36,31
N$14  (1 unrouted)
N$16
  Bottom 0.2: IC4.38 23.1,21.5 23,21.6 22.07,21.6 L6.2
N$17  (via drill 0.38)  (3 unrouted)
  Top 0.2: v19.6,24.2 19.2,24.2
  Bottom 0.2: IC4.42 26.3,23.5 25.2,24.6 24,24.6 23.6,25 23.6,26 | 23.6,26 23.6,27.18 C40.2 | 23.6,26 23.4,25.8 19.8,25.8 19.44,25.44 C27.2 18.84,24.96 v19.6,24.2 v18.8,24.2 18.8,24 | v18,24.2 18,24 v18.4,23.6 18.8,24 | 18.8,24 v19.2,23.6 | IC4.33 27,19 26.4,18.4 26.4,17.2 C55.2 v26,16
  other vias: 25.4,15.6
  pour Route2 (rank 2): 17.6,25.4 21,25.4 21.4,25 21.4,19 23.2,17.2 26.6,17.2 27.2,16.6 27.2,15.2 25.4,13.4 19.8,13.4 17.8,15.4 17.8,18.4 17.6,19.2
N$18  (via drill 0.38)  (6 unrouted)
  Top 0.2: v30,16.6 29.8,16.6 | v21.8,18 18.8,19.6
  Bottom 0.2: IC4.36 26.2,20.5 C50.2 25.1,18.5 25,18.4 23.6,18.4 23.2,18 19.8,18 19.6,18.2 19.6,19.32 C49.2 | 26.6,26.6 26.7,26.5 IC4.48 26.9,26.5 26.2,27.2 26.2,28.35 C36.2 v25.4,28.4 | IC4.25 31.3,17.7 31,17.4 30.8,17.4 30.6,17.2 C56.2 30.1,16.7 v30,16.6 | C49.2 19.66,19.14 v21.8,18 | C49.2 21.39,19.34 L6.1
  other vias: 25.8,27.6 21,18 20.2,18
  pour Route2 (isolate 0.254): 31.2,17.4 29.8,17.4 28.4,18.2 27.2,18.4 27.2,27.2 26,28.4 26,28.8 25.4,29.4 22.2,29.6 21,28.4 21,21.8 20.2,21 20.2,16.8 26.2,16.8 28,15 30.4,15 31.2,15.8
N$19
  Bottom 0.2: IC4.43 26.4,24 25.2,25.2 24.2,25.2 24,25.4 24,28.2 23.4,28.8 23.25,28.8 L4.2
N$20
  Bottom 0.2: IC4.24 C62.2
N$22  (via drill 0.38)  (3 unrouted)
  Top 0.2: v32.6,30 32.6,29 | v19,30.2 18.8,30.2
  Bottom 0.2: IC4.9 37.5,22.5 38.2,23.2 C42.2 38.1,23.3 38.4,23.6 38.8,23.6 v39,24 | IC4.56 31.3,28.9 31.6,29.2 31.6,29.45 31.8,29.45 | 31.8,29.45 32.05,29.45 v32.6,30 | L4.1 20.16,29.65 C28.2 19.2,30 v19,30.2 | v18.6,31 18.6,30.6 v19,30.2 | v18.2,30.2 v19,30.2 | C30.2 31.8,29.45
  pour Route2 (rank 2): 17.4,29.8 17.4,26 24,26 24.4,29.8 26.4,31.8 31,31.8 31.4,32.2 32.4,32.2 33.2,31.4 33.2,31.2 32.8,30.8 32.4,30.8 32,30.4 32,29.8 32.4,29.4 34.2,29.4 35.6,28 35.8,27.6 36.2,27 36.2,22.6 36.4,22.4 38.8,22.4 40,23.6 40,29.4 36,33.4 19.2,33.4 17.6,31.8
N$23
  Bottom 0.2: IC4.40 26.1,22.5 25,23.6 21.67,23.4 L5.2
N$24
  Bottom 0.2: IC4.41 26.2,23 25,24.2 23.2,24.2 23.2,24.6 22.4,24.8 21.67,25 L5.1
N$25
  Bottom 0.2: IC4.49 27.8,27.4 27.2,28 27.2,28.35 C32.2
N$32
  Bottom 0.2: IC4.51 28.8,29 28.4,29.4 28.4,30.8 27.8,31.4 27.2,31.4 26.6,32 26.6,32.79 X4.P$2 26,33.4 C25.2
N$40  (1 unrouted)
  Bottom 0.2: IC4.55 30.8,29 31,29.2 31,32.5 R3.1
N$48
  Bottom 0.406: R41.1 20.76,4.69 arc45 X6.1
SPI1_MISO  (via drill 0.38)
  Top 0.2: 38.8,25.6 v39.2,25.6 39,25.8 38,25.8 37.2,26.6 37.2,26.8 36,28 28.6,28 27.2,26.6 27.2,20.2 24.6,17.6 14,17.6 12.2,15.8 8,15.8 7.2,15 7.2,11 4.2,8 4.2,6.6 3.2,5.6 SV5.1
  Bottom 0.2: IC4.7 36.9,23.5 38.6,25.2 v39.2,25.6
SPI1_MOSI  (via drill 0.38)
  Top 0.2: 39.4,26.6 v39.5,26.8 39.4,26.8 38.8,26.2 38.2,26.2 37.6,26.8 37.6,27 36.2,28.4 28.4,28.4 26.8,26.8 26.8,20.4 24.4,18 13.8,18 12,16.2 7.6,16.2 7,15.6 7,11.6 3.54,8.14 SV5.2
  Bottom 0.2: IC4.6 36.8,24 38.4,25.6 38.4,26.2 38.8,26.2 39.4,26.8 v39.5,26.8
SPI1_NSS  (via drill 0.38)
  Top 0.2: v40,23.8 39.95,24.39 39.54,24.8 38.8,24.8 38.6,25 38.6,25.2 38.4,25.4 37.8,25.4 36.8,26.4 36.8,26.6 35.8,27.6 28.8,27.6 27.6,26.4 27.6,20 24.8,17.2 20.4,17.2 20.2,17 14.2,17 12.4,15.2 8.6,15.2 7.8,14.4 7.8,3.6 6.8,2.6 SV6.1
  Bottom 0.2: IC4.8 37.2,23 37.4,23.2 37.4,23.4 38.8,24.8 39.2,24.8 39.6,24.6 v40,23.8
SPI1_SCK  (via drill 0.38)
  Top 0.2: SV5.3 3,12.4 7.4,16.8 12,16.8 13.6,18.4 24.2,18.4 26.4,20.6 26.4,27 28.2,28.8 36.4,28.8 38.2,27 v38.4,27
  Bottom 0.2: IC4.5 36.7,24.5 38,25.8 38,26.6 v38.4,27
USART6_TX  (1 unrouted)
  Bottom 0.2: IC4.57 31.8,28.6 32.4,29.2 32.8,29.2 33.4,29.8 33.4,30.8 34.4,31.8
WIFI_!HIB  (1 unrouted)
  Top 0.2: SV6.3 5.2,6.2 4,5 2.6,5 1,6.6 1,15.8 3.2,18 10.8,18 12.4,19.6 15,19.6 15.8,20.4 15.8,34.4 19.8,38.4 34.2,38.4 34.6,38.8
  Bottom 0.2: IC4.2 36.4,26 36.8,26.4 36.8,27.8 35.8,28.8 35.8,29.6 36.6,30.4
WIFI_!RESET  (1 unrouted)
  Bottom 0.2: IC4.32 27.8,18.2 26.8,17.2 26.8,15.6 25,13.8 24.4,13.8 23.9,14.3 | 23.9,14.3 23.2,15 RN3.7 | 23.9,14.3 22.66,13.06 C64.2 22.24,12.04 20.4,10.2 12.2,10.2 11.2,11.2 10.81,11.2 S6.1
WIFI_FORCE_AP
  Bottom 0.2: IC4.4 36.6,25 37.6,26 37.6,27.4 37.8,27.6 38,27.6 38.2,27.8 RN2.7
WIFI_INTR  (via drill 0.38)
  Top 0.2: 8,6.4 6.74,5.14 SV6.2 1,9.34 1,15 3.6,17.6 11.4,17.6 12.8,19 15.8,19 16.8,20 16.8,34.2 19,36.4 32.8,36.4 34.4,34.8 34.4,33.6 35.4,32.6 41.6,32.6 45.2,29 45.2,16.8 44.2,15.8 42.8,15.8 42,16.6 v39.2,16.6
  Bottom 0.2: RN1.6 39.8,15.6 | IC4.15 36.7,19.5 36.8,19.4 36.8,17.6 38,16.4 39,16.4 v39.2,16.6
  Bottom 0.254: 39.8,15.6 39.8,16 v39.2,16.6
WIFI_SOP0
  Bottom 0.2: IC4.35 26.6,20 26,19.4 26,19.2 25.6,18.8 25.6,18 25.4,17.8 24.4,17.8 24,17.4 23.18,17.4 RN3.5 22.52,16.6
WIFI_SOP1
  Bottom 0.2: IC4.34 26.7,19.5 26.4,19.2 26.4,19 26,18.6 26,17.6 25.8,17.4 24.6,17.4 24.2,17 23.8,17 23.4,16.6 23.4,16 23.2,15.8 RN3.6
WIFI_SOP2
  Bottom 0.2: IC4.21 33.3,17.5 33.8,17 36.2,17 37.6,15.6 R1.2